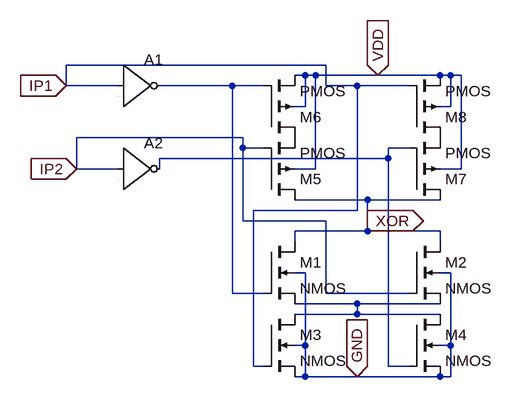
[diagram p0: schematic XOR.asc]
XOR.asc, the LTspice schematic file:
Version 4
SHEET 1 880 680
WIRE 320 -80 -80 -80
WIRE 288 -64 272 -64
WIRE 304 -64 288 -64
WIRE 400 -64 304 -64
WIRE 496 -64 400 -64
WIRE 512 -64 496 -64
WIRE 528 -64 512 -64
WIRE -80 -48 -80 -80
WIRE 0 -48 -80 -48
WIRE 176 -48 64 -48
WIRE 224 -48 176 -48
WIRE 320 -48 320 -80
WIRE 368 -48 320 -48
WIRE 448 -48 368 -48
WIRE 288 -16 288 -64
WIRE 288 -16 272 -16
WIRE 512 -16 512 -64
WIRE 512 -16 496 -16
WIRE 192 32 -64 32
WIRE 192 48 192 32
WIRE 224 48 192 48
WIRE 448 48 416 48
WIRE 416 64 416 48
WIRE 416 64 64 64
WIRE -64 80 -64 32
WIRE 0 80 -64 80
WIRE 64 80 64 64
WIRE 304 80 304 -64
WIRE 304 80 272 80
WIRE 528 80 528 -64
WIRE 528 80 496 80
WIRE 384 128 272 128
WIRE 496 128 384 128
WIRE 368 144 368 -48
WIRE 368 144 208 144
WIRE 192 160 192 48
WIRE 320 160 192 160
WIRE 384 160 384 128
WIRE 384 176 384 160
WIRE 384 176 272 176
WIRE 496 176 384 176
WIRE 272 192 272 176
WIRE 496 192 496 176
WIRE 288 240 272 240
WIRE 512 240 496 240
WIRE 176 272 176 -48
WIRE 224 272 176 272
WIRE 320 272 320 160
WIRE 448 272 320 272
WIRE 368 288 272 288
WIRE 496 288 368 288
WIRE 368 304 368 288
WIRE 368 304 272 304
WIRE 496 304 368 304
WIRE 288 352 288 240
WIRE 288 352 272 352
WIRE 512 352 512 240
WIRE 512 352 496 352
WIRE 208 384 208 144
WIRE 224 384 208 384
WIRE 416 384 416 64
WIRE 448 384 416 384
WIRE 288 400 288 352
WIRE 288 400 272 400
WIRE 368 400 288 400
WIRE 496 400 368 400
WIRE 512 400 512 352
WIRE 512 400 496 400
FLAG -80 -48 IP1
IOPIN -80 -48 In
FLAG -64 80 IP2
IOPIN -64 80 In
FLAG 368 400 GND
IOPIN 368 400 In
FLAG 400 -64 VDD
IOPIN 400 -64 In
FLAG 384 160 XOR
IOPIN 384 160 Out
SYMBOL nmos4 224 192 R0
SYMATTR InstName M1
SYMBOL nmos4 448 192 R0
SYMATTR InstName M2
SYMBOL nmos4 224 304 R0
SYMATTR InstName M3
SYMBOL nmos4 448 304 R0
SYMATTR InstName M4
SYMBOL pmos4 224 128 M180
SYMATTR InstName M5
SYMBOL pmos4 224 32 M180
SYMATTR InstName M6
SYMBOL pmos4 448 128 M180
SYMATTR InstName M7
SYMBOL pmos4 448 32 M180
SYMATTR InstName M8
SYMBOL Digital\\inv 0 -112 R0
SYMATTR InstName A1
SYMBOL Digital\\inv 0 16 R0
SYMATTR InstName A2

The netlist it stands for:
* XOR.asc
M1 XOR N001 N003 GND NMOS
M2 XOR IP2 N003 GND NMOS
M3 N003 IP1 GND GND NMOS
M4 N003 N002 GND GND NMOS
M5 XOR IP2 P001 VDD PMOS
M6 P001 N001 VDD VDD PMOS
M7 XOR N002 P002 VDD PMOS
M8 P002 IP1 VDD VDD PMOS
A1 IP1 0 0 0 0 N001 0 0 BUF
A2 IP2 0 0 0 0 N002 0 0 BUF
.model NMOS NMOS
.model PMOS PMOS
.lib standard.mos
.backanno
.end